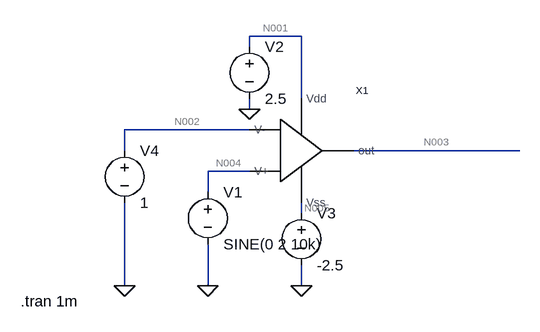
[diagram p0: schematic 2d.asc]
2d.asc, the LTspice schematic file:
Version 4
SHEET 1 880 680
WIRE 224 -32 144 -32
WIRE 144 -16 144 -32
WIRE 224 64 224 -32
WIRE 144 80 144 64
WIRE 144 112 -48 112
WIRE -48 144 -48 112
WIRE 560 144 304 144
WIRE 144 176 80 176
WIRE 80 208 80 176
WIRE 224 240 224 224
WIRE -48 352 -48 224
WIRE 80 352 80 288
WIRE 224 352 224 320
FLAG 80 352 0
FLAG 224 352 0
FLAG 144 80 0
FLAG -48 352 0
SYMBOL voltage 80 192 R0
WINDOW 123 24 44 Left 2
WINDOW 39 0 0 Left 0
SYMATTR InstName V1
SYMATTR Value SINE(0 2 10k)
SYMBOL voltage 144 -32 R0
WINDOW 123 0 0 Left 0
WINDOW 39 0 0 Left 0
SYMATTR InstName V2
SYMATTR Value 2.5
SYMBOL voltage 224 224 R0
WINDOW 123 0 0 Left 0
WINDOW 39 0 0 Left 0
SYMATTR InstName V3
SYMATTR Value -2.5
SYMBOL OPAMP 112 144 R0
SYMATTR InstName X1
SYMBOL voltage -48 128 R0
WINDOW 123 24 44 Left 2
WINDOW 39 0 0 Left 0
SYMATTR InstName V4
SYMATTR Value 1
TEXT -208 376 Left 2 !.tran 1m

The netlist it stands for:
* 2d.asc
V1 N004 0 SINE(0 2 10k)
V2 N001 0 2.5
V3 N005 0 -2.5
XX1 N001 N005 N002 N004 N003 OPAMP  ; pins Vdd Vss V- V+ out
V4 N002 0 1
.tran 1m
.backanno
.end

* Results of the author's LTspice run, read from the files saved beside the schematic
* Operating Point, zero values left out:
*   V(n001) = 2.5 V
*   V(n005) = -2.5 V
*   V(n002) = 1 V
*   V(n003) = -2.5 V
*   I(V2) = -61.53 µA
*   I(V3) = 61.53 µA
*   Ix(x1:VDD) = 61.53 µA
*   Ix(x1:VSS) = -61.53 µA
*   Ix(x1:OUT) = -6.272 pA
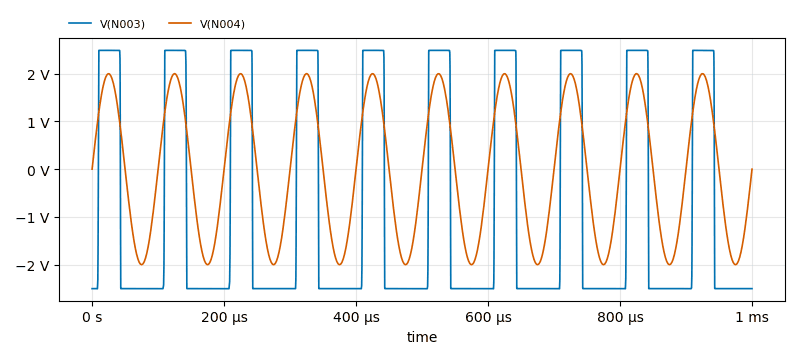
[diagram p1: Transient Analysis of 2d.asc, plotted from the saved traces]
* Transient Analysis, 1 run:
*   V(N003): min -2.504 V, max 2.487 V, average -832.7 mV, rms 2.477 V, last -2.5 V
*   V(N004): min -2 V, max 2 V, average 246.1 µV, rms 1.414 V, last 0 V